# Altium project GPSBoard.PrjPCB
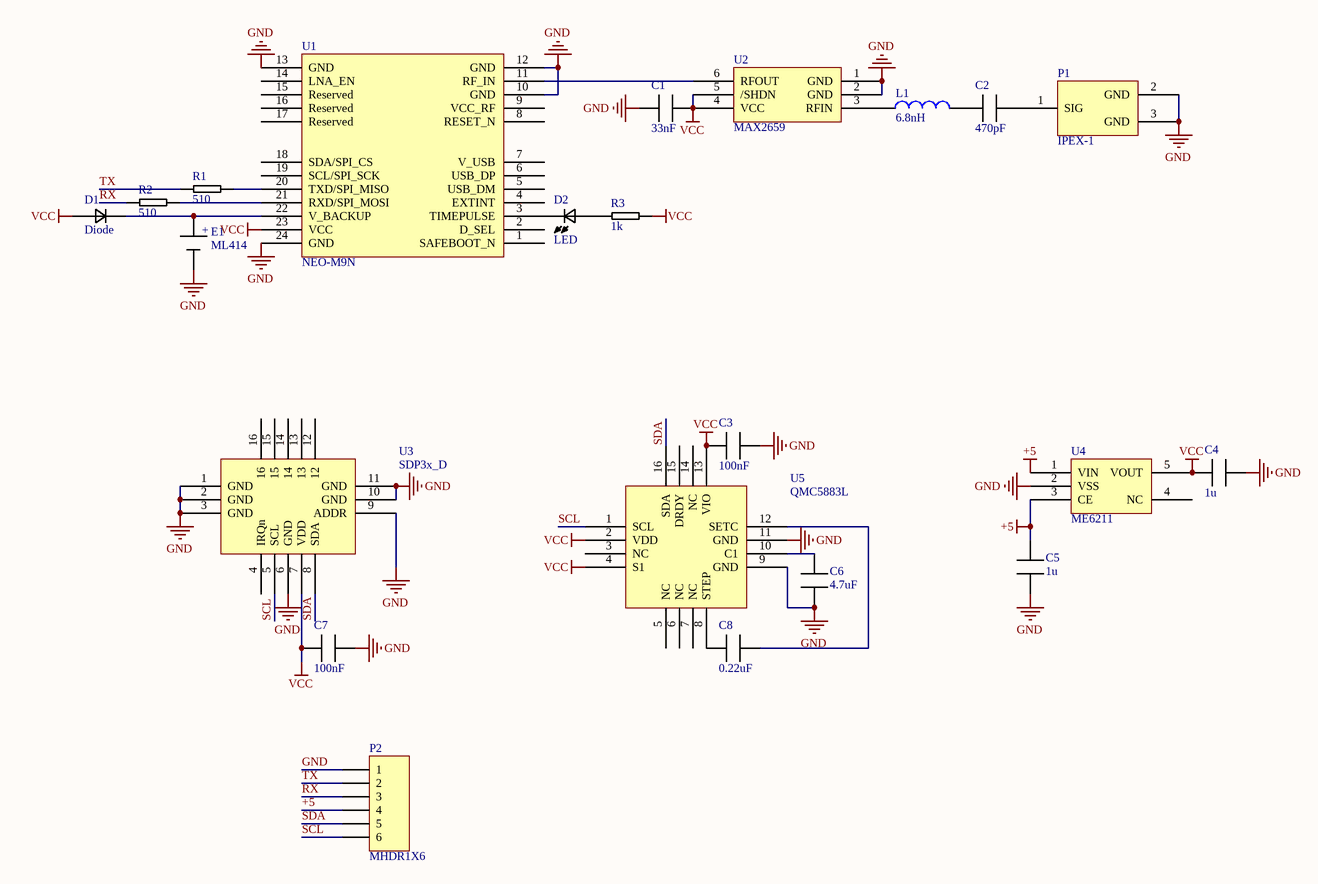
[diagram p0: Sheet1.SchDoc]
1 sheet, 22 parts. Net scope: global (net labels, ports and power ports of the same name join across sheets).
Board file: PCB1.PcbDoc

## Sheet Sheet1.SchDoc
size A3

### Parts
C1  33nF  [0603-Cap]
C2  470pF  [0603-Cap]
C3  100nF  [0603]
C4  1u  [0603-Cap]
C5  1u  [0603-Cap]
C6  4.7uF  [0603]
C7  100nF  [0603]
C8  0.22uF  [0603]
D1  Diode  [SOD-523]
D2  LED  [0603-1]
E1  ML414  [ML-414]
L1  6.8nH  [0603]
P1  IPEX-1  [IPEX-1]
P2  MHDR1X6  [MHDR1X6]
R1  510  [0603]
R2  510  [0603]
R3  1k  [0603]
U1  NEO-M9N  [NEO-M9N]
U2  MAX2659  [uDFN-6]
U3  SDP3x_D  [SDP3x]
U4  ME6211  [SC70-5]
U5  QMC5883L  [QMC5883]

### Nets
+5: C5.2 P2.4 U4.1(VIN) U4.3(CE)
GND: C1.1 C3.2 C4.2 C5.1 C6.1 C7.2 E1.2 P1.2(GND) P1.3(GND) P2.1 U1.10(GND) U1.12(GND) U1.13(GND) U1.24(GND) U2.1(GND) U2.2(GND) U3.1(GND) U3.2(GND) U3.3(GND) U3.6(GND) U3.9(ADDR) U3.10(GND) U3.11(GND) U4.2(VSS) U5.9(GND) U5.11(GND)
VCC: C1.2 C3.1 C4.1 C7.1 D1.1 R3.2 U1.23(VCC) U2.4(VCC) U2.5(/SHDN) U3.7(VDD) U4.5(VOUT) U5.2(VDD) U5.4(S1) U5.13(VIO)
RX: P2.3 R2.1
SCL: P2.6 U3.5(SCL) U5.1(SCL)
SDA: P2.5 U3.8(SDA) U5.16(SDA)
TX: P2.2 R1.1
NetC2_1: C2.1 L1.2
NetC2_2: C2.2 P1.1(SIG)
NetC6_2: C6.2 U5.10(C1)
NetC8_1: C8.1 U5.8(STEP)
NetC8_2: C8.2 U5.12(SETC)
NetD1_2: D1.2 E1.1 U1.22(V_BACKUP)
NetD2_1: D2.1 R3.1
NetD2_2: D2.2 U1.3(TIMEPULSE)
NetL1_1: L1.1 U2.3(RFIN)
NetR1_2: R1.2 U1.20(TXD/SPI_MISO)
NetR2_2: R2.2 U1.21(RXD/SPI_MOSI)
NetU1_11: U1.11(RF_IN) U2.6(RFOUT)

Not connected (* = marked no-connect by the designer): U1 1(SAFEBOOT_N) 2(D_SEL) 4(EXTINT) 5(USB_DM) 6(USB_DP) 7(V_USB) 8(RESET_N) 9(VCC_RF) 14(LNA_EN) 15(Reserved) 16(Reserved) 17(Reserved) 18(SDA/SPI_CS) 19(SCL/SPI_SCK); U3 4(IRQn) 12 13 14 15 16; U4 4(NC); U5 3(NC) 5(NC) 6(NC) 7(NC) 14(NC) 15(DRDY)

### Notes on the sheet
- (in symbol BAT) +

### Library data of the parts
C1-C8 = Cap
E1 = BAT
L1 = Inductor
P2 = MHDR1X6: Header, 6-Pin; LatestRevisionDate: 17-Jul-2002; LatestRevisionNote: Re-released for DXP Platform.; Publisher: Altium Limited
R1-R3 = Res